# Altium schematic sheet CAN_Connections.SchDoc
size A
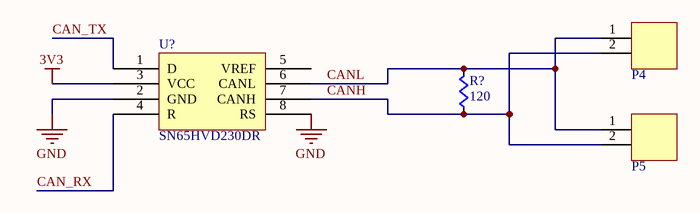
[diagram p0: CAN_Connections.SchDoc]

## Parts
P4  2-pin Horz Sherlock  [MOLEX-HDR-1X2-SHERLOCK-HORZ]  (value not drawn)
P5  2-pin Horz Sherlock  [MOLEX-HDR-1X2-SHERLOCK-HORZ]  (value not drawn)
R?  value 120  [RES0603]  (hidden comment: Res)
U?  SN65HVD230DR  [SOIC-8pin]

## Nets
3V3: U?.3(VCC)
GND: U?.2(GND) U?.8(RS)
CAN_RX: U?.4(R)
CAN_TX: U?.1(D)
CANH: P4.2 P5.2 R?.2(B) U?.7(CANH)
CANL: P4.1 P5.1 R?.1(A) U?.6(CANL)

Not connected (* = marked no-connect by the designer): U? 5(VREF)

## Library data of the parts
P4 P5 = MOLEX-HDR-1x2-SHERLOCK_RA: Header, Molex, 2mm Pitch Sherlock Header, Single Row, Horizontal, 2 Circuits, Length 3.3mm,  0353630260; Manufacturer: Molex Inc; Manufacturer Part Number: 0353630260; Supplier Part Number 1: WM18931-ND; Supplier 1: Digi-Key
U? = SN65HVD230DR: IC TXRX CAN 1MBPS 3.3V 8SOIC; Supplier 1: Digi-Key; Supplier Part Numbe 1: 296-11654-1-ND
R? = Res: Supplier 1: Digi-Key; Supplier Part Number 1: RMCF0603JT10K0CT-ND